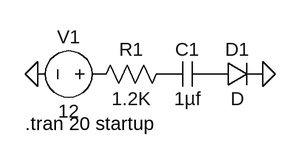
[diagram p0: schematic Draft4.asc]
Draft4.asc, the LTspice schematic file:
Version 4
SHEET 1 880 680
FLAG 32 80 0
FLAG 320 80 0
SYMBOL res 208 64 R90
WINDOW 0 0 56 VBottom 2
WINDOW 3 32 56 VTop 2
SYMATTR InstName R1
SYMATTR Value 1.2K
SYMBOL cap 256 64 R90
WINDOW 0 0 32 VBottom 2
WINDOW 3 32 32 VTop 2
SYMATTR InstName C1
SYMATTR Value 1µf
SYMBOL voltage 128 80 R90
WINDOW 0 -32 56 VBottom 2
WINDOW 3 32 56 VTop 2
WINDOW 123 0 0 Left 0
WINDOW 39 0 0 Left 0
SYMATTR InstName V1
SYMATTR Value 12
SYMBOL diode 256 96 R270
WINDOW 0 32 32 VTop 2
WINDOW 3 0 32 VBottom 2
SYMATTR InstName D1
TEXT 16 144 Left 2 !.tran 20 startup

The netlist it stands for:
* Draft4.asc
R1 P001 P002 1.2K
C1 P003 P001 1µf
V1 P002 0 12
D1 P003 0 D
.model D D
.lib standard.dio
.tran 20 startup
.backanno
.end

* Results of the author's LTspice run, read from the files saved beside the schematic
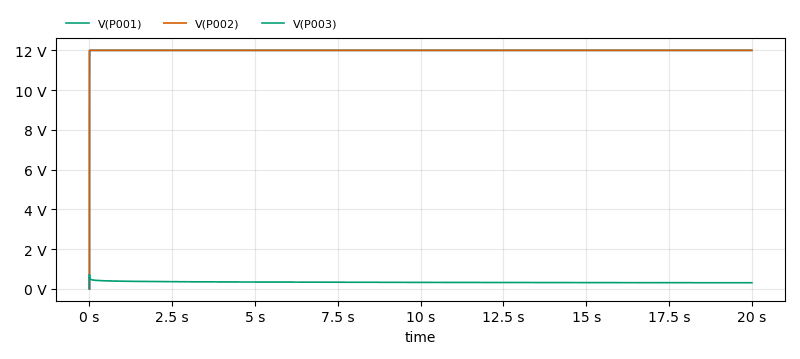
[diagram p1: Transient Analysis of Draft4.asc, plotted from the saved traces]
* Transient Analysis, 1 run:
*   V(P001): min 0 V, max 12 V, average 12 V, rms 12 V, last 12 V
*   V(P002): min 0 V, max 12 V, average 12 V, rms 12 V, last 12 V
*   V(P003): min 0 V, max 713.1 mV, average 331.1 mV, rms 332.2 mV, last 304.4 mV